# Altium project Node_CamBien.PrjPcb
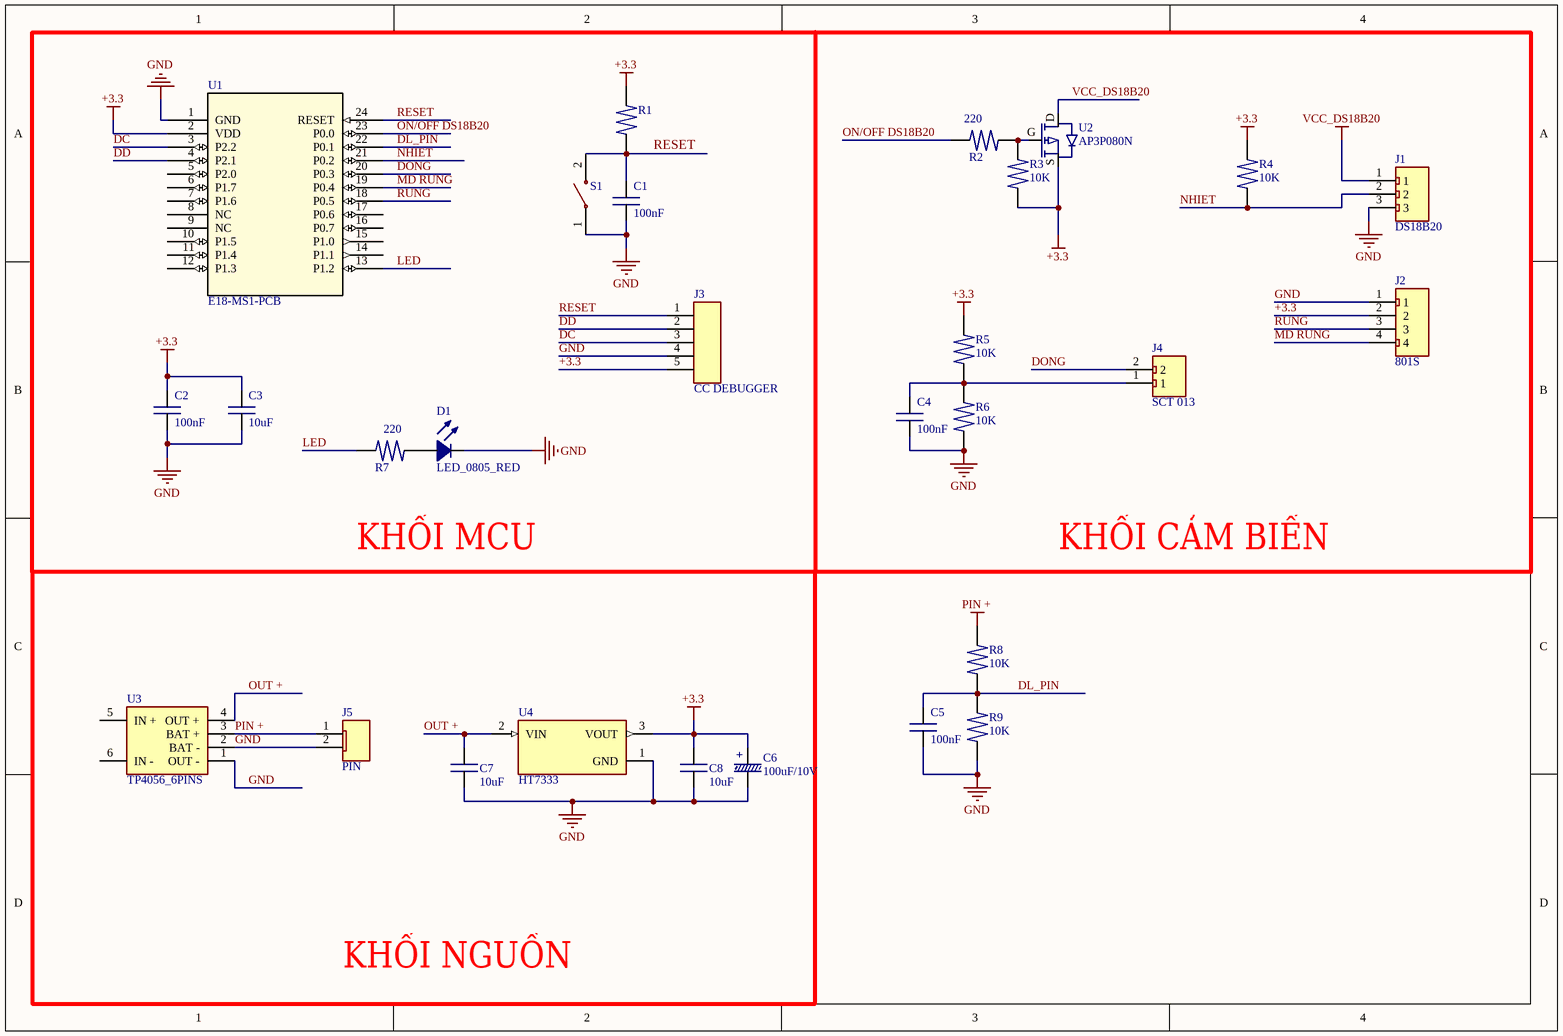
[diagram p0: Nguyen_Ly.SchDoc]
1 sheet, 28 parts. Net scope: global (net labels, ports and power ports of the same name join across sheets).
Board file: Mach_In.PcbDoc

## Sheet Nguyen_Ly.SchDoc
size A4; SheetNumber: 1; SheetTotal: 1

### Parts
C1  100nF  [CAPACITOR 0805]
C2  100nF  [CAPACITOR 0805]
C3  10uF  [CAPACITOR 0805]
C4  100nF  [CAPACITOR 0805]
C5  100nF  [CAPACITOR 0805]
C6  100uF/10V  [ALUMINUM_5mm]
C7  10uF  [CAPACITOR 0805]
C8  10uF  [CAPACITOR 0805]
D1  LED_0805_RED  [LED_0805_RED]
J1  DS18B20  [BORNE-5.00-3P]
J2  801S  [BORNE-5.00-4P]
J3  CC DEBUGGER  [MALE-2.54-5P]
J4  SCT 013  [BORNE-5.00-2P]
J5  PIN  [JST-2.54-2P]
R1  RESISTOR_0805  [RESISTOR_0805]  (value not drawn)
R2  220  [RESISTOR_0805]
R3  10K  [RESISTOR_0805]
R4  10K  [RESISTOR_0805]
R5  10K  [RESISTOR_0805]
R6  10K  [RESISTOR_0805]
R7  220  [RESISTOR_0805]
R8  10K  [RESISTOR_0805]
R9  10K  [RESISTOR_0805]
S1  PUSH_BUTTON_SMD_3X4X2  [PUSH_BUTTON_SMD_3X4X2]  (value not drawn)
U1  E18-MS1-PCB  [E18-MS1-PCB_BYT]
U2  AP3P080N  [SOT23-3]
U3  TP4056_6PINS  [TP4056_6PINs]
U4  HT7333  [IC_HT7333]

### Blocks framed on the sheet
KHỐI MCU: C1-C3 D1 J3 R1 R7 S1 U1

### Nets
+3.3: C2.2 C3.2 C6.1 C8.2 J2.2 J3.5 R1.2 R3.1 R4.2 R5.2 U1.2(VDD) U2.S U4.3(VOUT)
GND: C1.1 C2.1 C3.1 C4.1 C5.1 C6.2 C7.1 C8.1 D1.2 J1.3 J2.1 J3.4 J5.2 R6.1 R9.1 S1.1 U1.1(GND) U3.1(OUT_-) U3.2(BAT_-) U4.1(GND)
PIN +: J5.1 R8.2 U3.3(BAT_+)
VCC_DS18B20: J1.1 U2.D
DC: J3.3 U1.3(P2.2)
DD: J3.2 U1.4(P2.1)
DL_PIN: C5.2 R8.1 R9.2 U1.22(P0.1)
DONG: J4.2 U1.20(P0.3)
LED: R7.2 U1.13(P1.2)
MD RUNG: J2.4 U1.19(P0.4)
NHIET: J1.2 R4.1 U1.21(P0.2)
ON/OFF DS18B20: R2.2 U1.23(P0.0)
OUT +: C7.2 U3.4(OUT_+) U4.2(VIN)
RESET: C1.2 J3.1 R1.1 S1.2 U1.24(RESET)
RUNG: J2.3 U1.18(P0.5)
NetC4_2: C4.2 J4.1 R5.1 R6.2
NetD1_1: D1.1 R7.1
NetR2_1: R2.1 R3.2 U2.G

Not connected (* = marked no-connect by the designer): U1 5(P2.0) 6(P1.7) 7(P1.6) 8(NC) 9(NC) 10(P1.5) 11(P1.4) 12(P1.3) 14(P1.1) 15(P1.0) 16(P0.7) 17(P0.6); U3 5(IN_+) 6(IN_-)

### Notes on the sheet
- KHỐI CẢM BIẾN
- KHỐI NGUỒN
- (in symbol 100uF/10V) +

### Library data of the parts
C1-C5 C7 C8 = CAPACITOR 0805: Generic Capacitor 0805, 2x1.25x1.4mm.
C6 = 100uF/10V: Aluminum Capacitor 100uF/10V 5mm
D1 = LED_0805_RED: LED 0805 Red.; JLCPCB PN: C113551
J1 = BORNE-5.00-3P: Borne 3 Vias, Pitch 5mm.; JLCPCB PN: C91154
J2 = BORNE-5.00-4P: Borne 4 Vias, Pitch 5mm.; JLCPCB PN: C2915641
J3 = MALE-2.54-5P: Male Header Connector 2.54mm 5 Pins.; JLCPCB PN: C492404
J4 = BORNE-5.00-2P: Borne 2 Vias, Pitch 5mm.; JLCPCB PN: C91153
J5 = JST-2.54-2P: Female Connector JST 2 Vias, 2.54mm.
R1-R9 = RESISTOR_0805: Generic Resistor 0805.
S1 = PUSH_BUTTON_SMD_3X4X2: Push Button Tactile Switch SMD 2 Pins 3x4x2mm.; JLCPCB PN: C231644
U1 = E18-MS1-PCB: No Description Available; Manufacturer_Name: Chengdu Ebyte Elec Tech; Copyright: Copyright (C) 2026 Ultra Librarian. All rights reserved.; Manufacturer_Part_Number: E18-MS1-PCB; RefDes: RefDes; Type: Type
U2 = AP3P080N: Mosfet PNP
U3 = TP4056_6PINS: MODULE BATTERY CHARGER 6 PINS
U4 = HT7333: Three-terminal, low power, high voltage regulator implemented in CMOS technology; MF: Holtek Semiconductor; SnapEDA_Link: https://www.snapeda.com/parts/HT7333/Holtek/view-part/?ref=snap; Package: None; Value: *; MP: HT7333; Check_prices: https://www.snapeda.com/parts/HT7333/Holtek/view-part/?ref=eda